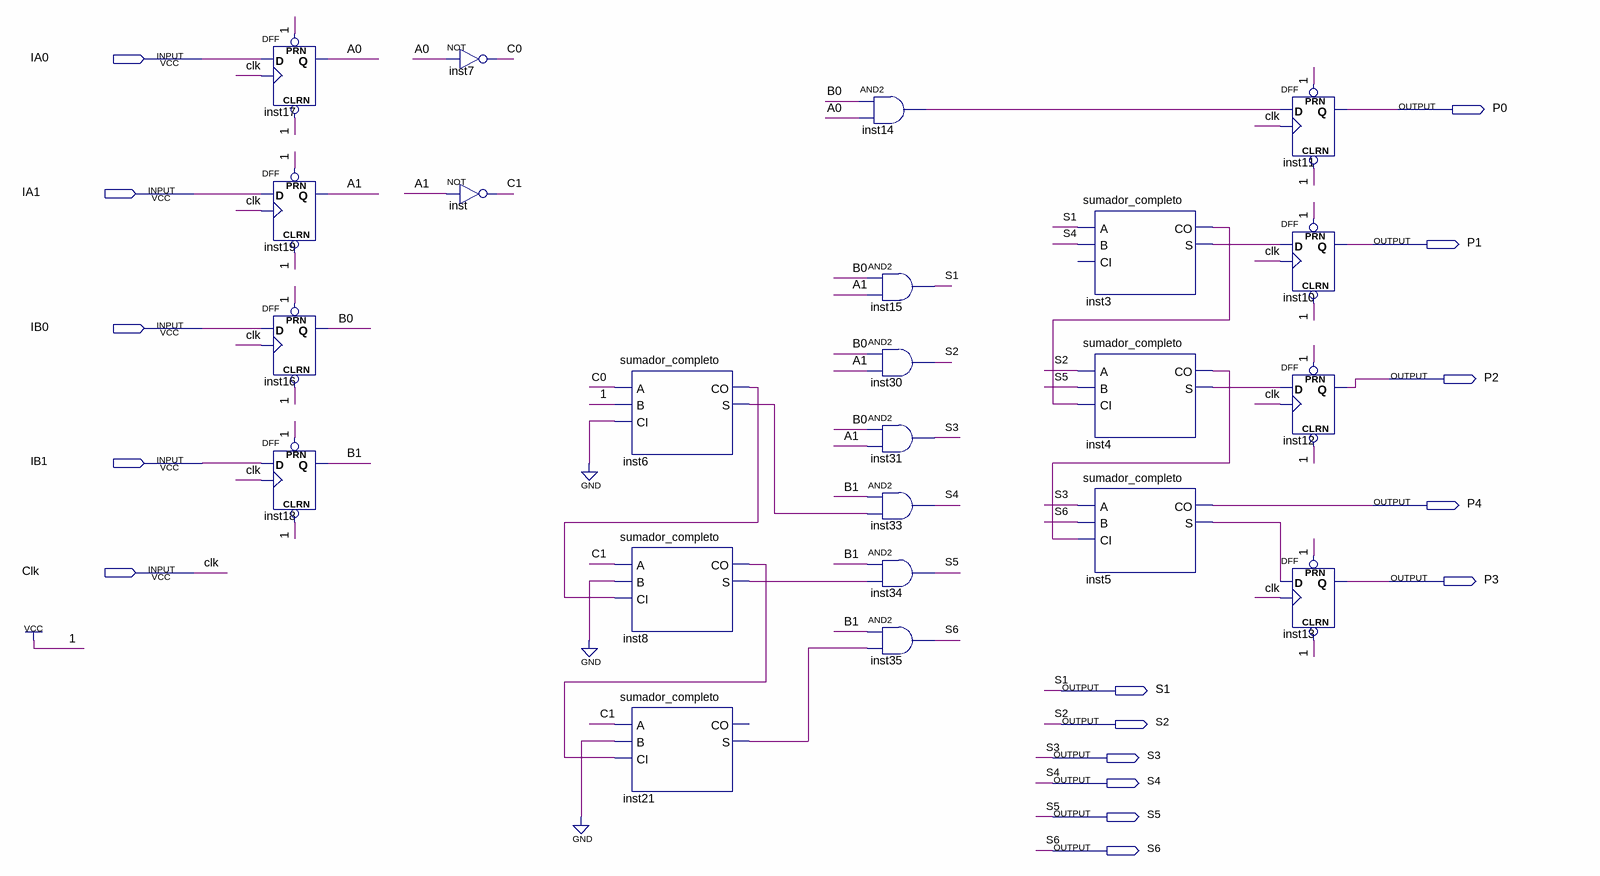
[diagram p0: schematic sheet]
// Quartus schematic MultiBC.bdf as structural Verilog: 23 symbols, 16 pins
module MultiBC (
  input  IA0,
  input  IA1,
  input  IB0,
  input  IB1,
  input  Clk,
  output P0,
  output P1,
  output P2,
  output P4,
  output P3,
  output S1,
  output S2,
  output S3,
  output S4,
  output S5,
  output S6
);

  wire A0, A1, B0, B1, C0, C1, inst3_co, inst3_s, inst4_co, inst4_s, inst5_s, inst6_co, inst6_s, inst8_co,
       inst8_s, inst14_out, inst21_s;

  DFF inst17 (.CLRN(1'b1), .CLK(Clk), .D(IA0), .PRN(1'b1), .Q(A0));
  DFF inst19 (.CLRN(1'b1), .CLK(Clk), .D(IA1), .PRN(1'b1), .Q(A1));
  DFF inst16 (.CLRN(1'b1), .CLK(Clk), .D(IB0), .PRN(1'b1), .Q(B0));
  DFF inst18 (.CLRN(1'b1), .CLK(Clk), .D(IB1), .PRN(1'b1), .Q(B1));
  not inst7 (C0, A0);
  not inst (C1, A1);
  sumador_completo inst6 (.A(C0), .B(1'b1), .CI(1'b0), .CO(inst6_co), .S(inst6_s));
  sumador_completo inst8 (.A(C1), .B(1'b0), .CI(inst6_co), .CO(inst8_co), .S(inst8_s));
  sumador_completo inst21 (.A(C1), .B(1'b0), .CI(inst8_co), .S(inst21_s));  // open: CO
  and inst14 (inst14_out, B0, A0);
  and inst15 (S1, B0, A1);
  and inst30 (S2, B0, A1);
  and inst31 (S3, B0, A1);
  and inst33 (S4, B1, inst6_s);
  and inst34 (S5, B1, inst8_s);
  and inst35 (S6, B1, inst21_s);
  sumador_completo inst3 (.A(S1), .B(S4), .CO(inst3_co), .S(inst3_s));  // open: CI
  sumador_completo inst4 (.A(S2), .B(S5), .CI(inst3_co), .CO(inst4_co), .S(inst4_s));
  sumador_completo inst5 (.A(S3), .B(S6), .CI(inst4_co), .CO(P4), .S(inst5_s));
  DFF inst11 (.CLRN(1'b1), .CLK(Clk), .D(inst14_out), .PRN(1'b1), .Q(P0));
  DFF inst10 (.CLRN(1'b1), .CLK(Clk), .D(inst3_s), .PRN(1'b1), .Q(P1));
  DFF inst12 (.CLRN(1'b1), .CLK(Clk), .D(inst4_s), .PRN(1'b1), .Q(P2));
  DFF inst13 (.CLRN(1'b1), .CLK(Clk), .D(inst5_s), .PRN(1'b1), .Q(P3));
endmodule
